# EAGLE design AudioSwitch (EAGLE 9.5.2)
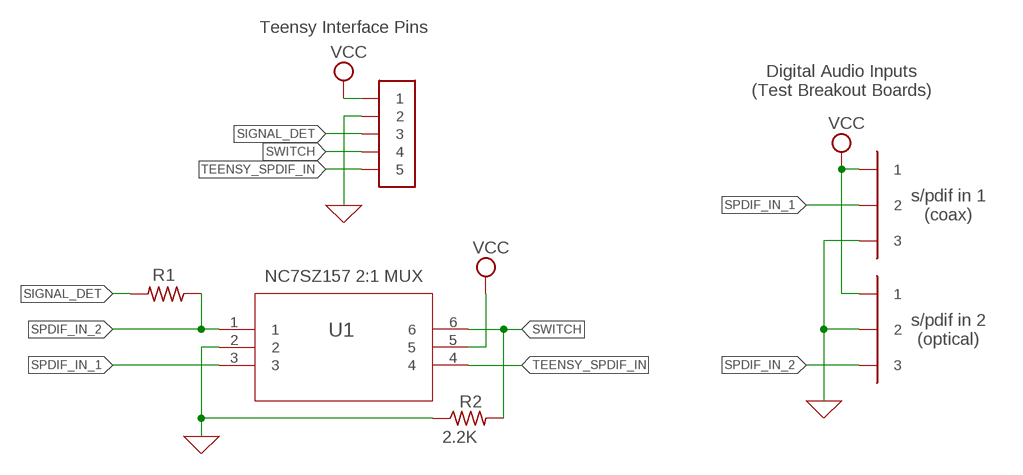
[diagram p0: schematic, sheet 1]

## Parts
R1  R-US_R0603  [R0603]
R2  2.2K  R-US_R0603  [R0603]
U1  2:1_MUX_NC7SZ157P6X  [SOIC_Z157P6X_ONS]
U$1  1X5HEADER  [1X5HEADER]
U$2  1X3HEADER  [1X3HEADER]
U$3  1X3HEADER  [1X3HEADER]

## Nets
0: R2.1 U1.2 U$1.P$2 U$2.P$3 U$3.P$2 ; supply symbol labelled GND
SIGNAL_DET: R1.2 U$1.P$3
SPDIF_IN_1: U1.3 U$2.P$2
SPDIF_IN_2: R1.1 U1.1 U$3.P$3
SWITCH: R2.2 U1.6 U$1.P$4
TEENSY_SPDIF_IN: U1.4 U$1.P$5
VCC [power]: U1.5 U$1.P$1 U$2.P$1 U$3.P$1

## Notes on the sheet
- Teensy Interface Pins
- Digital Audio Inputs
  (Test Breakout Boards)
- s/pdif in 1
  (coax)
- NC7SZ157 2:1 MUX
- s/pdif in 2
  (optical)

## Library data of the parts
R1 R2 = rcl:R-US_: RESISTOR, American symbol; SPICEPREFIX: R
U1 = AudioSwitch:2:1_MUX_NC7SZ157P6X; DATASHEET: https://datasheet.octopart.com/NC7SZ157P6X-ON-Semiconductor-datasheet-137360983.pdf; MANUFACTURER_PART_NUMBER: NC7SZ157P6X; SOURCELIBRARY: ON_Semiconductor_2020-03-06; VENDOR: ON Semiconductor
U$1 = 1x2HEADER:1X5HEADER
U$2 U$3 = 1x2HEADER:1X3HEADER

## Net classes
0 default: width 0.254 mm
1 power: width 0.381 mm

## Board
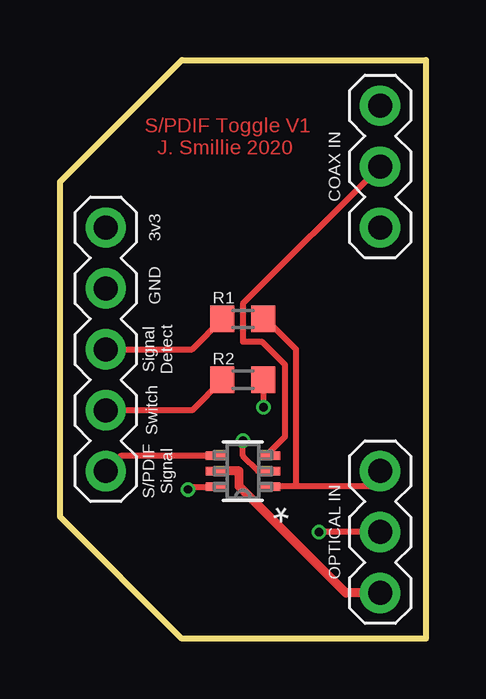
[diagram p1: board, top side]
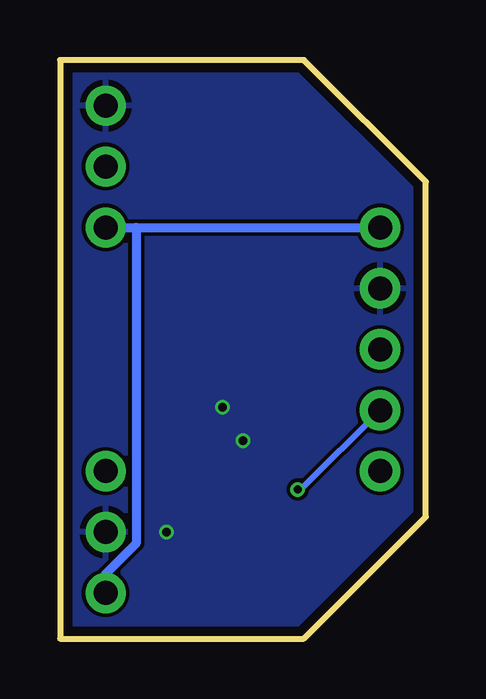
[diagram p2: board, bottom side, seen from below]

Size 15.24 x 24.13 mm. Coordinates in mm from the lower left corner, seen from the top.
Outline: 0,5.08 0,19.05 5.08,24.13 15.24,24.13 15.24,0 5.08,0 0,5.08
Copper layers (1*16): Top 0.035559375mm / dielectric 1.6mm / Bottom 0.035559375mm
Design rules "oshpark-2layer *": minimum track width 6mil, minimum drill 10mil, track to track 6mil, track to pad 6mil, pad to pad 6mil, via to via 6mil, smd to smd 6mil, copper to edge 15mil, drill to drill 6mil, minimum pad ring 5mil, minimum via ring 5mil, stop-mask expansion 2.5mil, vias tented up to drill 20mil, thermal gap 10mil

### Footprints (pad centres in the part's own frame; a part is rotated, then mirrored left to right if it is on the bottom)
R0603 = smd 1 x 1.1: 1 -0.85,0; 2 0.85,0
SOIC_Z157P6X_ONS = smd 0.876 x 0.356: 1 -1.111,0.65; 2 -1.111,0; 3 -1.111,-0.65; 4 1.111,-0.65; 5 1.111,0; 6 1.111,0.65
1X5HEADER = drill 1 pad 1.676: P$1 1.27,1.27; P$2 3.81,1.27; P$3 6.35,1.27; P$4 8.89,1.27; P$5 11.43,1.27
1X3HEADER = drill 1 pad 1.676: P$1 1.27,1.27; P$2 3.81,1.27; P$3 6.35,1.27

### Placement (x,y rotation side)
R1  7.62,13.34 180 top
R2  7.62,10.79 180 top
U1  7.62,6.99 180 top
U$1  0.64,18.41 270 top
U$2  14.61,15.88 90 top
U$3  14.61,0.64 90 top

### Tracks (layer width: path | path; a pad name or v marks a point on that pad's centre or on a via)
0  (via drill 0.35)
  Top 0.254: U1.2 8.26,6.99 7.62,7.62 v7.62,8.26 | R2.1 v8.47,9.65 | U$3.P$2 v10.79,4.45
  pour Bottom: 17.78,27.94 17.78,-1.27 -1.91,-1.27 -1.91,27.94
SIGNAL_DET
  Top 0.254: U$1.P$3 5.5,12.06 R1.2
SPDIF_IN_1
  Top 0.254: U$2.P$2 7.62,13.97 7.62,12.38 8.41,12.38 9.37,11.43 9.37,8.41 8.73,7.78 U1.3
SPDIF_IN_2
  Top 0.254: 9.84,6.35 13.34,6.35 U$3.P$3 | 9.84,6.35 8.73,6.35 U1.1 | 9.84,6.35 9.84,12.06 8.57,13.34 R1.1
SWITCH  (via drill 0.35)
  Top 0.254: R2.2 5.5,9.53 U$1.P$4 | v5.33,6.22 5.45,6.33 U1.6
  Bottom 0.254: v5.33,6.22 5.21,6.22 U$1.P$4
TEENSY_SPDIF_IN
  Top 0.254: 6.51,7.62 U1.4 2.56,7.63 U$1.P$5
VCC
  Top 0.381: U1.5 7.46,6.99 7.46,6.35 11.91,1.91 U$3.P$1
  Bottom 0.381: U$2.P$1 12.06,17.14 | 12.06,17.14 U$1.P$1 | U$3.P$1 13.34,2.7 12.06,3.97 12.06,17.14

### Text on the board
Top: S/PDIF Toggle V1 / J. Smillie 2020
tNames: COAX IN | 3v3 | GND | Signal / Detect | Switch | S/PDIF / Signal | OPTICAL IN
tStop: S/PDIF Toggle V1 / J. Smillie 2020